# EAGLE design Rocketometer2148 MPU9150 GPS No Osc No Charge (EAGLE 6.5.0)
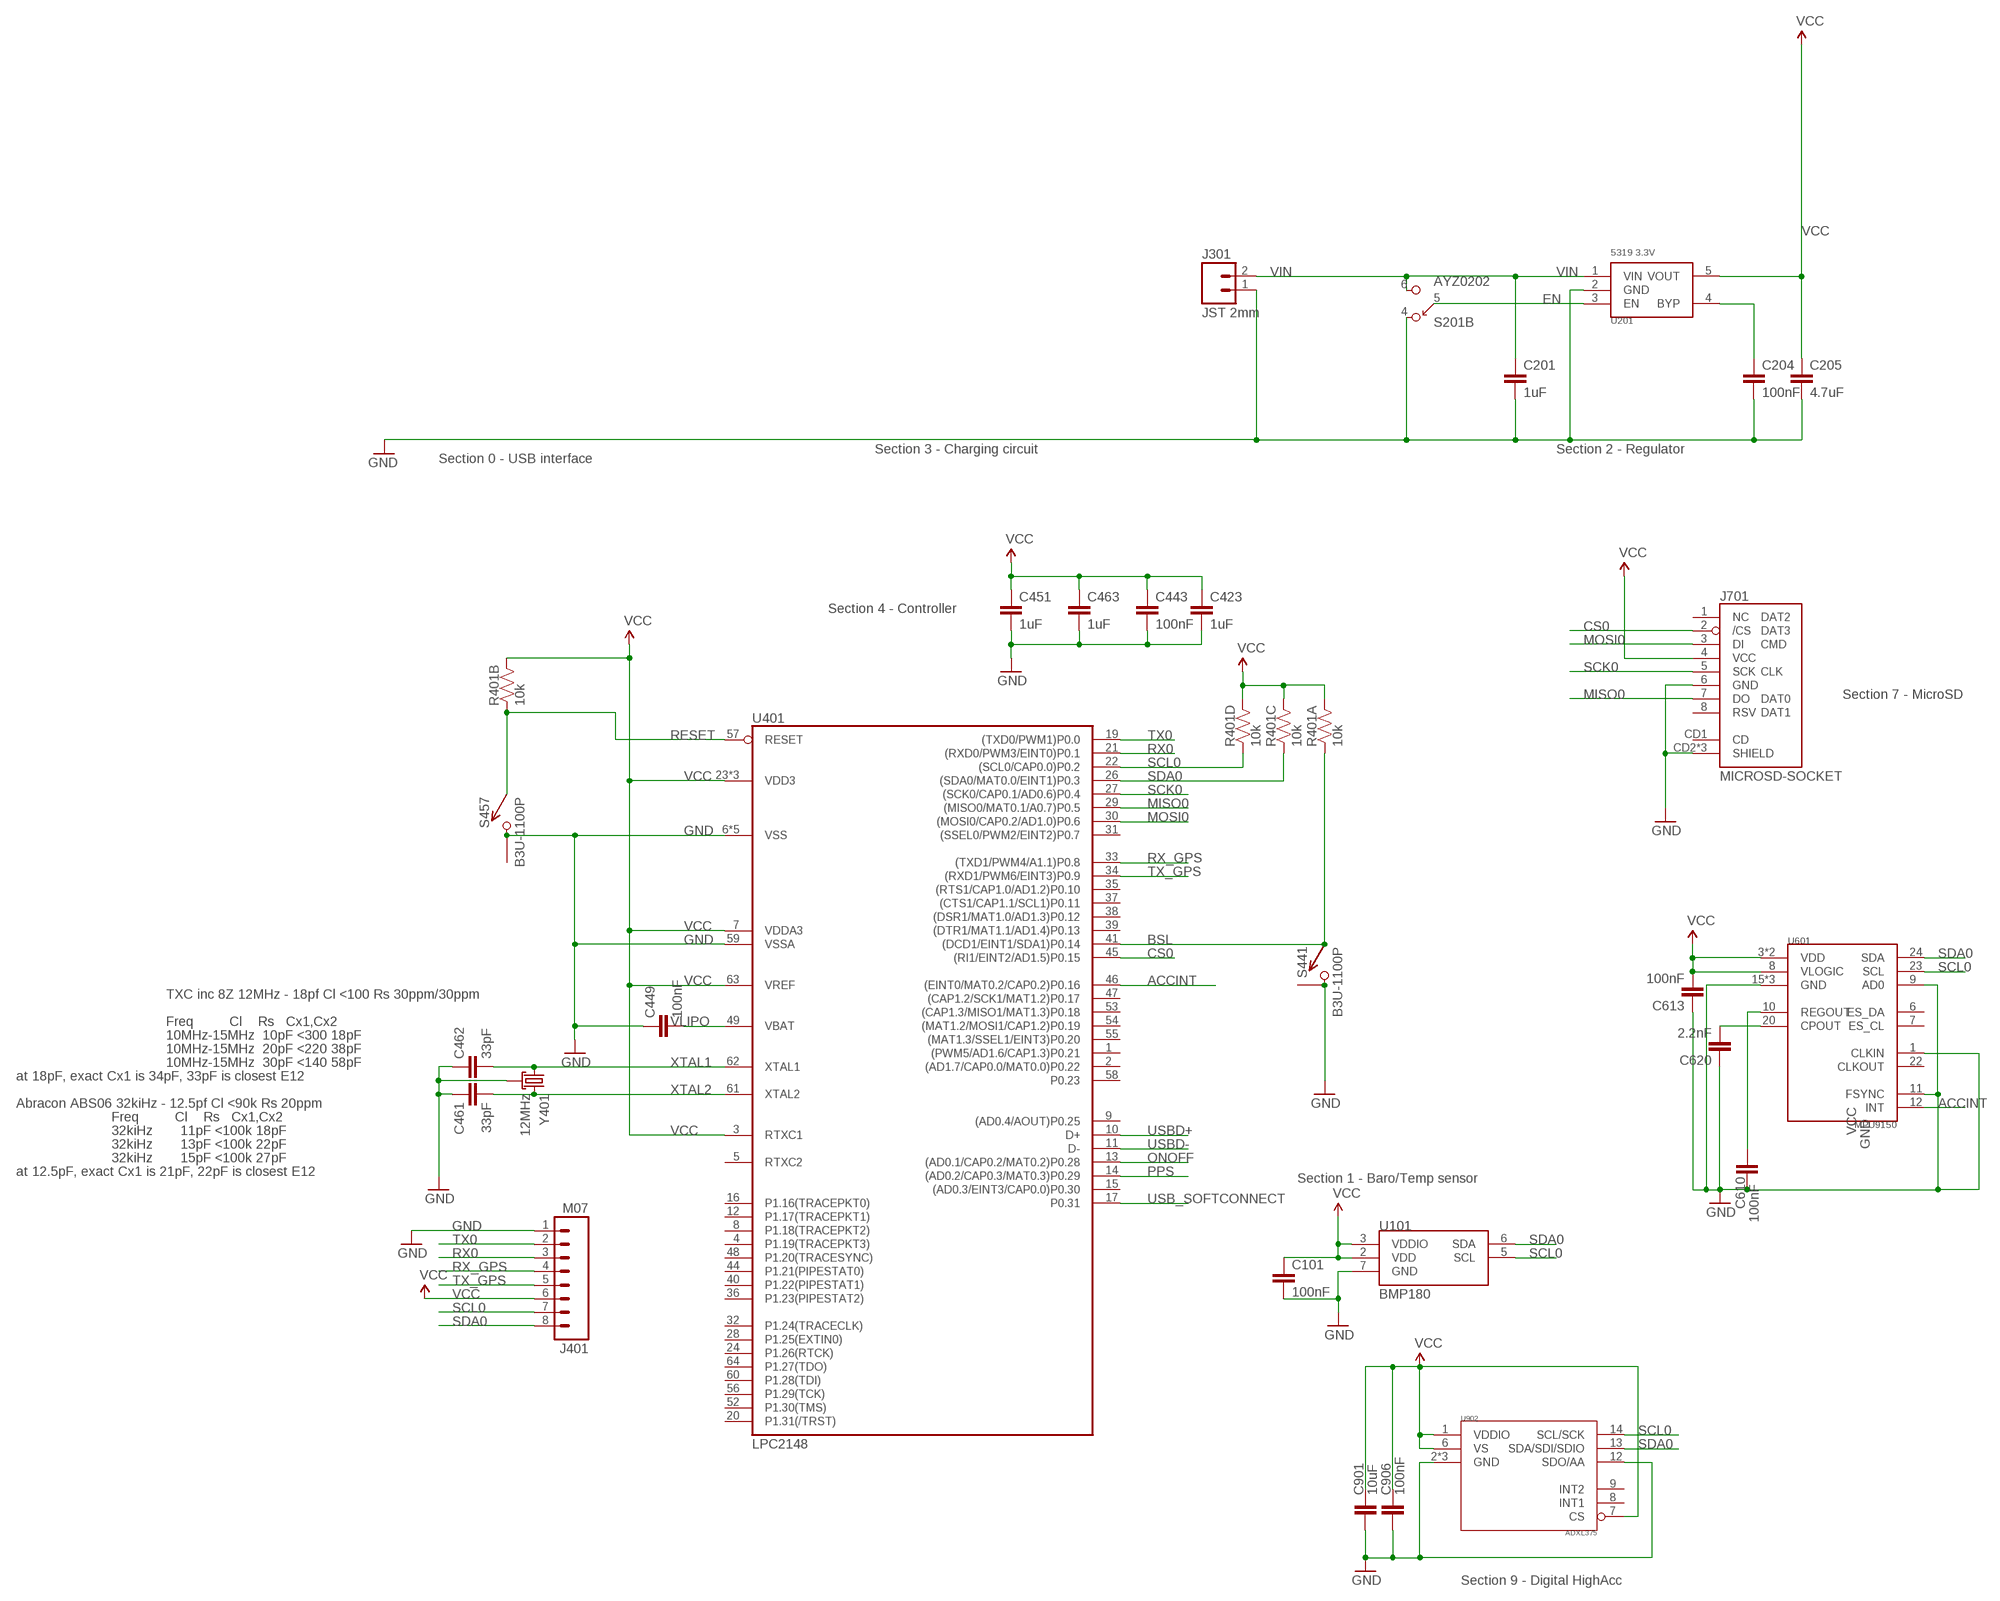
[diagram p0: schematic, sheet 1, part 1 of 2]
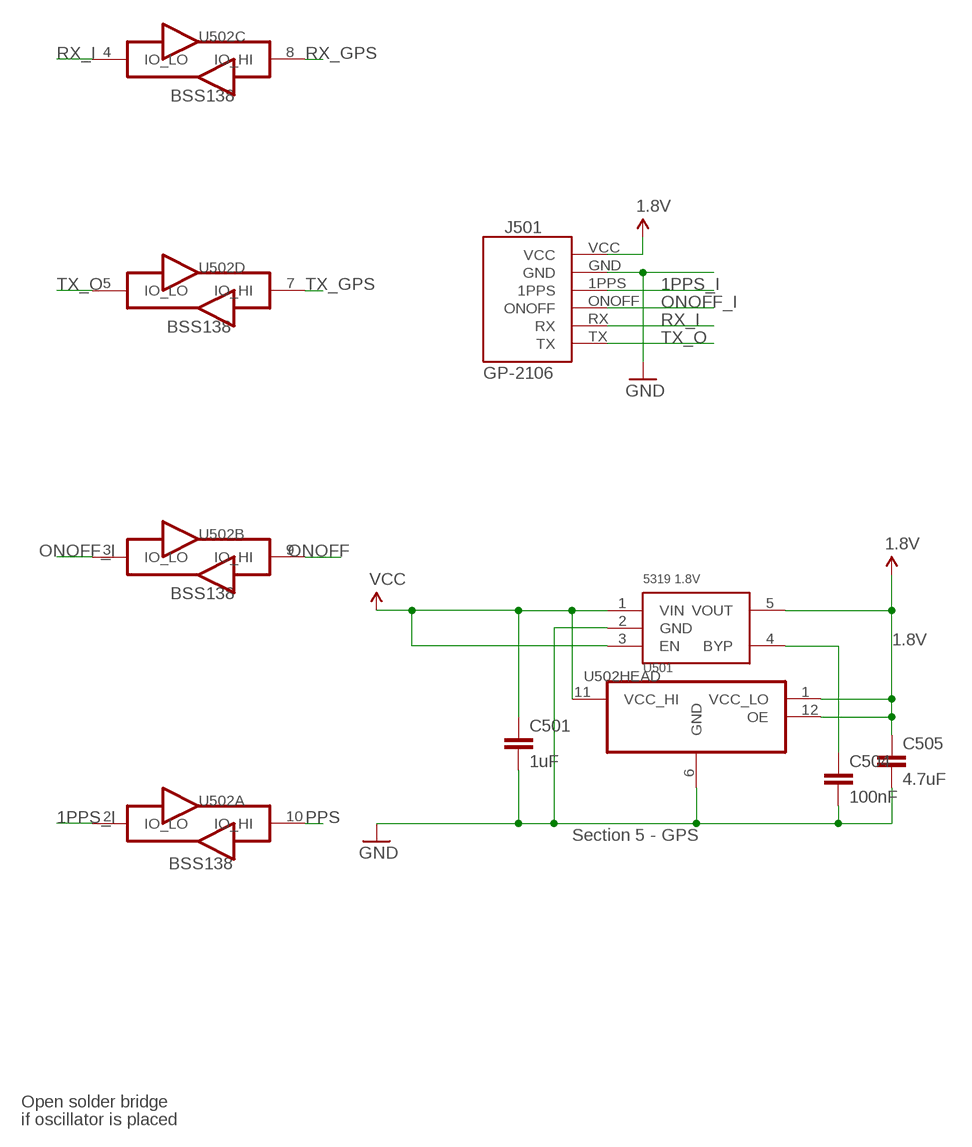
[diagram p1: schematic, sheet 1, part 2 of 2]

## Parts
C101  100nF  CAP0402-CAP  [0402-CAP]
C201  1uF  CAP0402-CAP  [0402-CAP]
C204  100nF  CAP0402-CAP  [0402-CAP]
C205  4.7uF  CAP0402-CAP  [0402-CAP]
C423  1uF  CAP0402-CAP  [0402-CAP]
C443  100nF  CAP0402-CAP  [0402-CAP]
C449  100nF  CAP0402-CAP  [0402-CAP]
C451  1uF  CAP0402-CAP  [0402-CAP]
C461  33pF  CAP0402-CAP  [0402-CAP]
C462  33pF  CAP0402-CAP  [0402-CAP]
C463  1uF  CAP0402-CAP  [0402-CAP]
C501  1uF  CAP0402-CAP  [0402-CAP]
C504  100nF  CAP0402-CAP  [0402-CAP]
C505  4.7uF  CAP0402-CAP  [0402-CAP]
C610  100nF  CAP0402-CAP  [0402-CAP]
C613  100nF  CAP0402-CAP  [0402-CAP]
C620  2.2nF  CAP0402-CAP  [0402-CAP]
C901  10uF  CAP0603-CAP  [0603-CAP]
C906  100nF  CAP0402-CAP  [0402-CAP]
J301  JST 2mm  M02-JST-2MM-SMT  [JST-2-SMD]
J401  M07  M081X08  [1X08]
J501  GP-2106  [GP-2106]
J701  MICROSD-SOCKET  [MICROSD-SOCKET-PP]
R401  10k  RP404  [CRA04]
S201  AYZ0202  [AYZ0202]
S441  B3U-1100P  [B3U-1100P]
S457  B3U-1100P  [B3U-1100P]
U101  BMP180  [BMP180]
U201  5319 3.3V  MIC5319D5  [SOT-23-5]
U401  LPC2148  [LQFP64]
U501  5319 1.8V  MIC5319D5  [SOT-23-5]
U502  TXB0104RUT  [R-PUQFN-N12]
U601  MPU9150  [LLGA24]
U902  ADXL375  [ADXL375]
Y401  12MHz  CX2520  [CRYSTAL_SMD_2MM_2_5MM]

## Nets
1.8V: C505.1 J501.VCC U501.5(VOUT) U502.1(HEAD:VCC_LO) U502.12(HEAD:OE)
1PPS_I: J501.1PPS U502.2(A:IO_LO)
ACCINT: U401.46((EINT0/MAT0.2/CAP0.2)P0.16) U601.12(INT)
BSL: R401.1 S441.P$1 U401.41((DCD1/EINT1/SDA1)P0.14)
CS0: J701.2(/CS) U401.45((RI1/EINT2/AD1.5)P0.15)
EN: S201.5 U201.3(EN)
GND [power]: C101.2 C201.2 C204.2 C205.2 C423.2 C443.2 C449.1 C451.2 C461.1 C462.1 C463.2 C501.2 C504.2 C505.2 C610.2 C613.1 C620.1 C901.2 C906.2 J301.1 J401.1 J501.GND J701.6(GND) J701.CD2(SHIELD) J701.GND1(SHIELD) J701.GND3(SHIELD) S201.4 S441.P$2 S441.P$3 S457.P$2 S457.P$3 U101.7(GND) U201.2(GND) U401.6(VSS) U401.18(VSS) U401.25(VSS) U401.42(VSS) U401.50(VSS) U401.59(VSSA) U501.2(GND) U502.6(HEAD:GND) U601.1(CLKIN) U601.9(AD0) U601.11(FSYNC) U601.15(GND) U601.17(GND) U601.18(GND) U902.2(GND) U902.4(GND) U902.5(GND) U902.12(SDO/AA) Y401.2(GND) Y401.4(GND)
MISO0: J701.7(DO) U401.29((MISO0/MAT0.1/A0.7)P0.5)
MOSI0: J701.3(DI) U401.30((MOSI0/CAP0.2/AD1.0)P0.6)
N$1: C620.2 U601.20(CPOUT)
N$12: C504.1 U501.4(BYP)
N$13: C610.1 U601.10(REGOUT)
N$17: C204.1 U201.4(BYP)
ONOFF: U401.13((AD0.1/CAP0.2/MAT0.2)P0.28) U502.9(B:IO_HI)
ONOFF_I: J501.ONOFF U502.3(B:IO_LO)
PPS: U401.14((AD0.2/CAP0.3/MAT0.3)P0.29) U502.10(A:IO_HI)
RESET [power]: R401.2 S457.P$1 U401.57(RESET)
RX0: J401.3 U401.21((RXD0/PWM3/EINT0)P0.1)
RX_GPS: J401.4 U401.33((TXD1/PWM4/A1.1)P0.8) U502.8(C:IO_HI)
RX_I: J501.RX U502.4(C:IO_LO)
SCK0: J701.5(SCK) U401.27((SCK0/CAP0.1/AD0.6)P0.4)
SCL0: J401.7 R401.4 U101.5(SCL) U401.22((SCL0/CAP0.0)P0.2) U601.23(SCL) U902.14(SCL/SCK)
SDA0: J401.8 R401.3 U101.6(SDA) U401.26((SDA0/MAT0.0/EINT1)P0.3) U601.24(SDA) U902.13(SDA/SDI/SDIO)
TX0: J401.2 U401.19((TXD0/PWM1)P0.0)
TX_GPS: J401.5 U401.34((RXD1/PWM6/EINT3)P0.9) U502.7(D:IO_HI)
TX_O: J501.TX U502.5(D:IO_LO)
USB_SOFTCONNECT: U401.17(P0.31)
USBD+: U401.10(D+)
USBD-: U401.11(D-)
VCC [power]: C101.1 C205.1 C423.1 C443.1 C451.1 C463.1 C501.1 C613.2 C901.1 C906.1 J401.6 J701.4(VCC) R401.5 R401.6 R401.7 R401.8 U101.2(VDD) U101.3(VDDIO) U201.5(VOUT) U401.3(RTXC1) U401.7(VDDA3) U401.23(VDD3) U401.43(VDD3) U401.51(VDD3) U401.63(VREF) U501.1(VIN) U501.3(EN) U502.11(HEAD:VCC_HI) U601.3(VDD) U601.8(VLOGIC) U601.13(VDD) U902.1(VDDIO) U902.6(VS) U902.7(CS)
VIN: C201.1 S201.6 U201.1(VIN)
VLIPO [power]: C449.2 U401.49(VBAT)
XTAL1: C462.2 U401.62(XTAL1) Y401.1
XTAL2: C461.2 U401.61(XTAL2) Y401.3
Unconnected: J301.2 J701.1(NC) J701.8(RSV) J701.CD1(CD) S201.1 S201.2 S201.3 U401.1((PWM5/AD1.6/CAP1.3)P0.21) U401.2((AD1.7/CAP0.0/MAT0.0)P0.22) U401.4(P1.19(TRACEPKT3)) U401.5(RTXC2) U401.8(P1.18(TRACEPKT2)) U401.9((AD0.4/AOUT)P0.25) U401.12(P1.17(TRACEPKT1)) U401.15((AD0.3/EINT3/CAP0.0)P0.30) U401.16(P1.16(TRACEPKT0)) U401.20(P1.31(/TRST)) U401.24(P1.26(RTCK)) U401.28(P1.25(EXTIN0)) U401.31((SSEL0/PWM2/EINT2)P0.7) U401.32(P1.24(TRACECLK)) U401.35((RTS1/CAP1.0/AD1.2)P0.10) U401.36(P1.23(PIPESTAT2)) U401.37((CTS1/CAP1.1/SCL1)P0.11) U401.38((DSR1/MAT1.0/AD1.3)P0.12) U401.39((DTR1/MAT1.1/AD1.4)P0.13) U401.40(P1.22(PIPESTAT1)) U401.44(P1.21(PIPESTAT0)) U401.47((CAP1.2/SCK1/MAT1.2)P0.17) U401.48(P1.20(TRACESYNC)) U401.52(P1.30(TMS)) U401.53((CAP1.3/MISO1/MAT1.3)P0.18) U401.54((MAT1.2/MOSI1/CAP1.2)P0.19) U401.55((MAT1.3/SSEL1/EINT3)P0.20) U401.56(P1.29(TCK)) U401.58(P0.23) U401.60(P1.28(TDI)) U401.64(P1.27(TDO)) U601.6(ES_DA) U601.7(ES_CL) U601.22(CLKOUT) U902.8(INT1) U902.9(INT2)

## Notes on the sheet
- BSS138
- Section 0 - USB interface | Section 3 - Charging circuit | Section 2 - Regulator
- BSS138
- Section 4 - Controller
- BSS138
- Section 7 - MicroSD
- Section 5 - GPS
- BSS138
- TXC inc 8Z 12MHz - 18pf Cl <100 Rs 30ppm/30ppm
- Freq         Cl    Rs   Cx1,Cx2
- 10MHz-15MHz  10pF <300 18pF
- 10MHz-15MHz  20pF <220 38pF
- 10MHz-15MHz  30pF <140 58pF | Open solder bridge
- at 18pF, exact Cx1 is 34pF, 33pF is closest E12 | if oscillator is placed
- Abracon ABS06 32kiHz - 12.5pf Cl <90k Rs 20ppm
- Freq         Cl    Rs   Cx1,Cx2
- 32kiHz       11pF <100k 18pF
- 32kiHz       13pF <100k 22pF
- 32kiHz       15pF <100k 27pF
- at 12.5pF, exact Cx1 is 21pF, 22pF is closest E12
- Section 1 - Baro/Temp sensor
- Section 9 - Digital HighAcc

## Library data of the parts
C101 C204 C443 C449 C504 C610 C613 = SparkFun:CAP: Capacitor Standard 0603 ceramic capacitor, and 0.1" leaded capacitor.; DIGIKEY: 445-1265-1-ND
C201 C423 C451 C463 C501 = SparkFun:CAP: Capacitor Standard 0603 ceramic capacitor, and 0.1" leaded capacitor.; DIGIKEY: 445-4114-1-ND
C205 C505 = SparkFun:CAP: Capacitor Standard 0603 ceramic capacitor, and 0.1" leaded capacitor.; DIGIKEY: 445-7395-1-ND
C461 C462 = SparkFun:CAP: Capacitor Standard 0603 ceramic capacitor, and 0.1" leaded capacitor.; DIGIKEY: 445-1241-1-ND
C620 = SparkFun:CAP: Capacitor Standard 0603 ceramic capacitor, and 0.1" leaded capacitor.; DIGIKEY: 445-1257-1-ND
C901 = SparkFun:CAP: Capacitor Standard 0603 ceramic capacitor, and 0.1" leaded capacitor.; DIGIKEY: 445-7486-1-ND
C906 = SparkFun-Passives:CAP: Capacitor Standard 0603 ceramic capacitor, and 0.1" leaded capacitor.; DIGIKEY: 445-1265-1-ND
J301 = SparkFun:M02: Header 2 Standard 2-pin 0.1" header. Use with straight break away headers (SKU : PRT-00116), right angle break away headers (PRT-00553), swiss pins (PRT-00743), machine pins (PRT-00117), and female headers (PRT-00115). Molex polarized connector foot print use with SKU : PRT-08233 with associated crimp pins and housings.; DIGIKEY: 455-1749-1-ND
J401 = SparkFun-Connectors:M08: Header 8 Standard 8-pin 0.1" header. Use with straight break away headers (SKU : PRT-00116), right angle break away headers (PRT-00553), swiss pins (PRT-00743), machine pins (PRT-00117), and female headers (PRT-00115).; DIGIKEY: $NOPART
J501 = SparkFun:GP-2106: GP-2106 GPS SiRF IV
J701 = KwanSystems:MICROSD-SOCKET: microSD Socket Push-push type uSD socket. Digikey 101-00660-68-6-1-ND. tDoc lines correctly indicate media card edge positions when inserting (unlocked, locked, depressed).; DIGIKEY: 101-00581-59-1-ND
R401 = KwanSystems:RP4; DIGIKEY: CRA4S810KCT-ND
S201 = KwanSystems:AYZ0202; DIGIKEY: 401-2013-1-ND
S441 S457 = KwanSystems:B3U-1100P; DIGIKEY: SW1021CT-ND
U101 = KwanSystems:BMP180; DIGIKEY: 828-1027-1-ND
U201 U501 = KwanSystems:MIC5319; DIGIKEY: 576-1910-1-ND
U401 = KwanSystems:LPC2148
U502 = KwanSystems:TXB0104
U601 = KwanSystems:MPU9150; DIGIKEY: $NOPART
U902 = KwanSystems:ADXL375; DIGIKEY: ADXL375BCCZ-ND
Y401 = KwanSystems:CX2520; DIGIKEY: 887-1487-1-ND

## Net classes
0 default: width 0.152 mm, drill 0.33 mm, clearance 0.152 mm
1 power: width 0.152 mm, drill 0.33 mm, clearance 0.152 mm to class 0, clearance 0.152 mm
2 hv: width 0.152 mm, drill 0.33 mm, clearance 0.152 mm to class 0, clearance 0.152 mm to class 1, clearance 0.152 mm

## Board
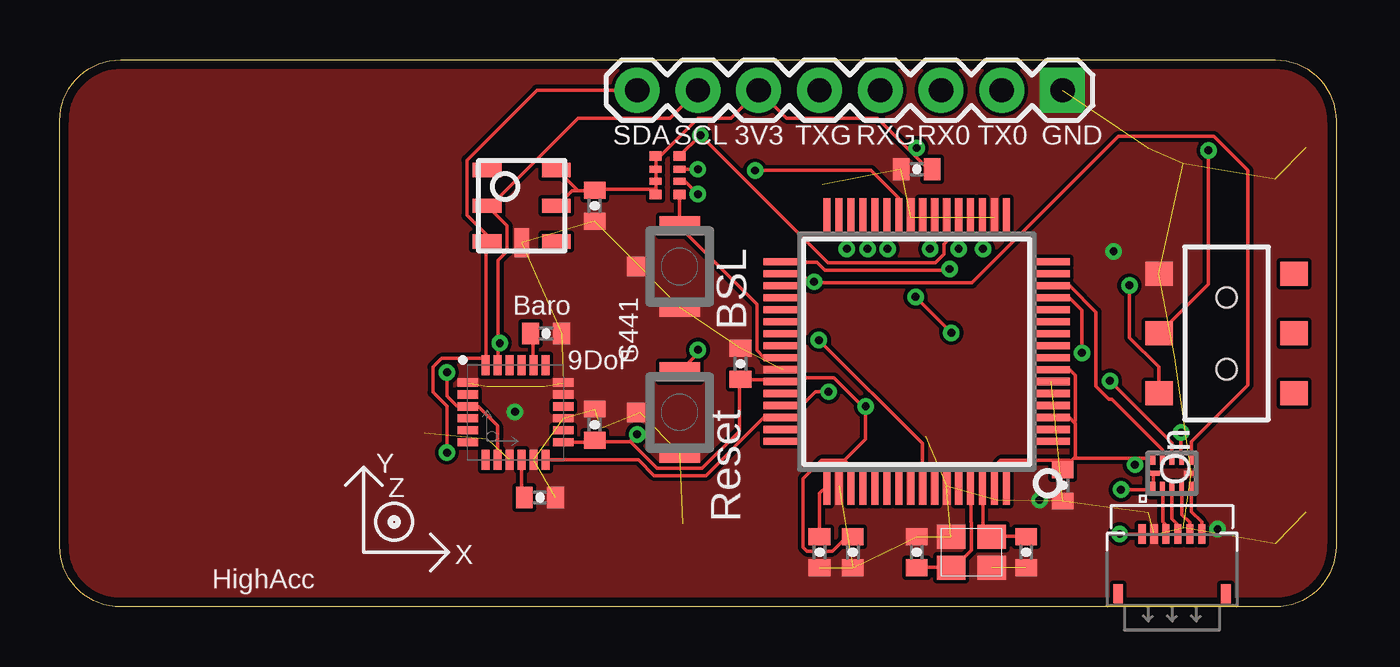
[diagram p2: board, top side]
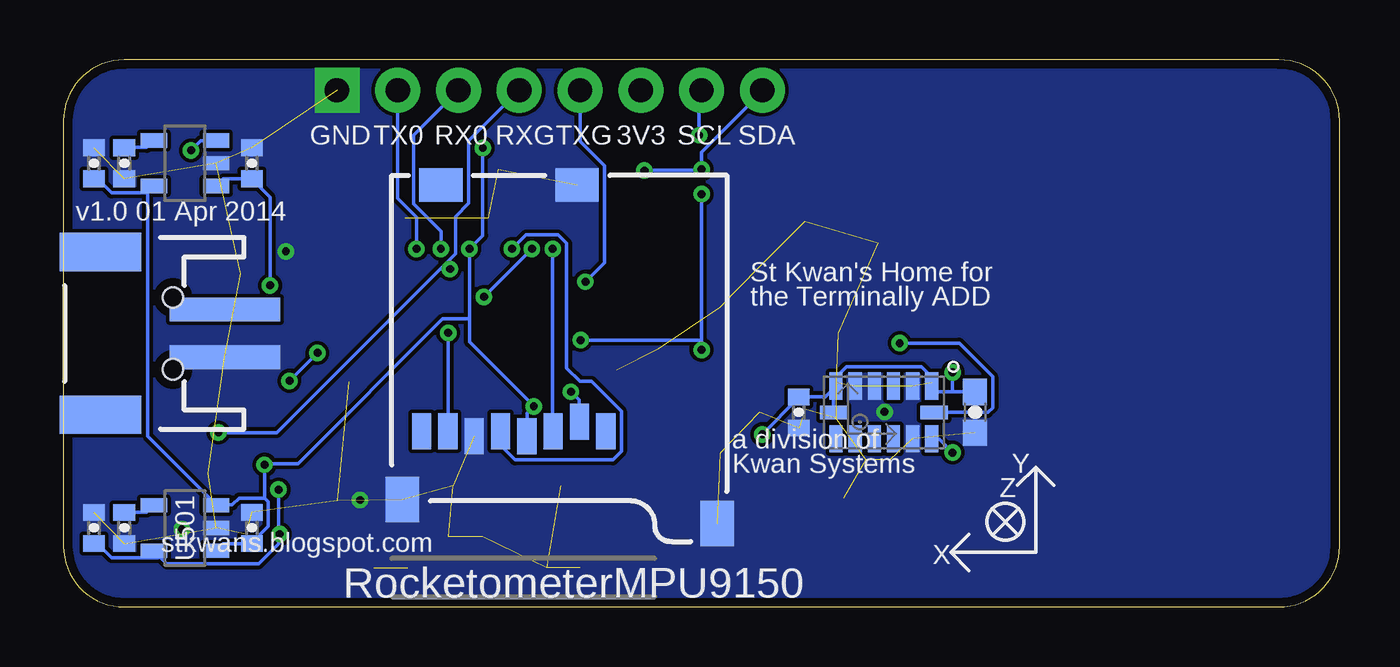
[diagram p3: board, bottom side, seen from below]

Size 53.34 x 22.86 mm. Coordinates in mm from the lower left corner, seen from the top.
Outline: 2.54,22.86 50.8,22.86 arc-90 53.34,20.32 53.34,2.54 arc-90 50.8,0 2.54,0 arc-90 0,2.54 0,20.32 arc-90 2.54,22.86
Copper layers (1*16): Top 0.0356mm / dielectric 1.5011mm / Bottom 0.0356mm
Design rules "default": minimum track width 6mil, minimum drill 13mil, track to track 6mil, track to pad 6mil, pad to pad 6mil, via to via 6mil, smd to smd 6mil, copper to edge 15mil, drill to drill 6mil, minimum pad ring 7mil, minimum via ring 7mil, stop-mask expansion 4mil, vias tented up to drill 14mil, thermal gap 10mil

### Footprints (pad centres in the part's own frame; a part is rotated, then mirrored left to right if it is on the bottom)
0402-CAP = smd 0.7 x 0.9: 1 -0.65,0; 2 0.65,0
0603-CAP = smd 1.1 x 1: 1 -0.85,0; 2 0.85,0
JST-2-SMD = smd 1 x 4.6: 1 -1,-3.7; 2 1,-3.7 | smd 1.6 x 3.4: NC1 -3.4,1.5; NC2 3.4,1.5
1X08 = drill 1.016 pad 1.88 square: 1 0,0 | drill 1.016 pad 1.88: 2 2.54,0; 3 5.08,0; 4 7.62,0; 5 10.16,0; 6 12.7,0; 7 15.24,0; 8 17.78,0
GP-2106 = smd 0.3 x 0.8: 1PPS -0.25,0; GND -0.75,0; ONOFF 0.25,0; RX 0.75,0; TX 1.25,0; VCC -1.25,0 | smd 0.4 x 0.8: P$7 -2.25,-2.5; P$8 2.25,-2.5
MICROSD-SOCKET-PP = smd 0.8 x 1.5: 1 -8.94,10.7; 2 -7.84,10.3; 3 -6.74,10.7; 4 -5.64,10.9; 5 -4.54,10.7; 6 -3.44,10.9; 7 -2.34,10.7; 8 -1.24,10.7 | smd 1.8 x 1.4: CD1 -2.05,0.4; CD2 -7.75,0.4 | smd 1.4 x 1.9: GND1 -13.6,14.55; GND3 -0.45,13.55
CRA04 = smd 0.4 x 0.5: 1 -0.8,-0.5; 4 0.8,-0.5; 5 0.8,0.5; 8 -0.8,0.5 | smd 0.3 x 0.5: 2 -0.25,-0.5; 3 0.25,-0.5; 6 0.25,0.5; 7 -0.25,0.5
AYZ0202 = smd 1 x 1.15: 1 -2.5,2.825; 2 0,2.825; 3 2.5,2.825; 4 -2.5,-2.825; 5 0,-2.825; 6 2.5,-2.825 | hole 0.85: 1.5,0; -1.5,0
B3U-1100P = smd 0.8 x 1.7: P$1 -1.7,0; P$2 1.7,0 | smd 0.8 x 1.1: P$3 0,-1.65
BMP180 = smd 0.6 x 1.2: 1 1.5,1.45; 2 0,1.45; 3 -1.5,1.45; 4 -1.5,-1.45; 5 0,-1.45; 6 1.5,-1.45 | smd 1.2 x 0.6: 7 1.55,0
SOT-23-5 = smd 0.6 x 1.1: 1 -0.95,-1.3; 2 0,-1.3; 3 0.95,-1.3; 4 0.95,1.3; 5 -0.95,1.3
LQFP64 = smd 0.3 x 1.6: 1 -3.75,-5.6; 2 -3.25,-5.6; 3 -2.75,-5.6; 4 -2.25,-5.6; 5 -1.75,-5.6; 6 -1.25,-5.6; 7 -0.75,-5.6; 8 -0.25,-5.6; 9 0.25,-5.6; 10 0.75,-5.6; 11 1.25,-5.6; 12 1.75,-5.6; 13 2.25,-5.6; 14 2.75,-5.6; 15 3.25,-5.6; 16 3.75,-5.6; 33 3.75,5.6; 34 3.25,5.6; 35 2.75,5.6; 36 2.25,5.6; 37 1.75,5.6; 38 1.25,5.6; 39 0.75,5.6; 40 0.25,5.6; 41 -0.25,5.6; 42 -0.75,5.6; 43 -1.25,5.6; 44 -1.75,5.6; 45 -2.25,5.6; 46 -2.75,5.6; 47 -3.25,5.6; 48 -3.75,5.6 | smd 1.6 x 0.3: 17 5.6,-3.75; 18 5.6,-3.25; 19 5.6,-2.75; 20 5.6,-2.25; 21 5.6,-1.75; 22 5.6,-1.25; 23 5.6,-0.75; 24 5.6,-0.25; 25 5.6,0.25; 26 5.6,0.75; 27 5.6,1.25; 28 5.6,1.75; 29 5.6,2.25; 30 5.6,2.75; 31 5.6,3.25; 32 5.6,3.75; 49 -5.6,3.75; 50 -5.6,3.25; 51 -5.6,2.75; 52 -5.6,2.25; 53 -5.6,1.75; 54 -5.6,1.25; 55 -5.6,0.75; 56 -5.6,0.25; 57 -5.6,-0.25; 58 -5.6,-0.75; 59 -5.6,-1.25; 60 -5.6,-1.75; 61 -5.6,-2.25; 62 -5.6,-2.75; 63 -5.6,-3.25; 64 -5.6,-3.75
R-PUQFN-N12 = smd 0.2 x 0.6: 1 -0.8,-0.65; 2 -0.4,-0.65; 3 0,-0.65; 4 0.4,-0.65; 5 0.8,-0.65; 7 0.8,0.65; 8 0.4,0.65; 9 0,0.65; 10 -0.4,0.65; 11 -0.8,0.65 | smd 0.6 x 0.2: 6 0.8,0; 12 -0.8,0
LLGA24 = smd 0.85 x 0.34: 1 -2,1.25; 2 -2,0.75; 3 -2,0.25; 4 -2,-0.25; 5 -2,-0.75; 6 -2,-1.25; 13 2,-1.25; 14 2,-0.75; 15 2,-0.25; 16 2,0.25; 17 2,0.75; 18 2,1.25 | smd 0.34 x 0.85: 7 -1.25,-1.975; 8 -0.75,-1.975; 9 -0.25,-1.975; 10 0.25,-1.975; 11 0.75,-1.975; 12 1.25,-1.975; 19 1.25,1.975; 20 0.75,1.975; 21 0.25,1.975; 22 -0.25,1.975; 23 -0.75,1.975; 24 -1.25,1.975
ADXL375 = smd 0.55 x 1.145: 1 2,1.097; 2 1.2,1.097; 3 0.4,1.097; 4 -0.4,1.097; 5 -1.2,1.097; 6 -2,1.097; 8 -2,-1.097; 9 -1.2,-1.097; 10 -0.4,-1.097; 11 0.4,-1.097; 12 1.2,-1.097; 13 2,-1.097 | smd 1.145 x 0.55: 7 -2.098,0; 14 2.098,0
CRYSTAL_SMD_2MM_2_5MM = smd 1.2 x 1: 1 -0.85,-0.65; 2 0.85,-0.65; 3 0.85,0.65; 4 -0.85,0.65

### Placement (x,y rotation side)
C101  22.35,16.76 270 top
C201  45.47,18.54 90 bottom
C204  50.8,18.54 270 bottom
C205  52.07,18.54 90 bottom
C423  35.81,18.29 180 top
C443  28.45,10.16 90 top
C449  31.75,2.29 90 top
C451  33.15,2.29 270 top
C461  35.81,2.29 270 top
C462  40.39,2.29 90 top
C463  41.91,5.08 270 top
C501  45.47,3.3 90 bottom
C504  50.8,3.3 270 bottom
C505  52.07,3.3 90 bottom
C610  20.07,4.57 0 top
C613  22.35,7.62 270 top
C620  20.32,11.43 180 top
C901  15.24,8.13 270 bottom
C906  22.61,8.13 270 bottom
J301  50.29,11.43 90 bottom
J401  41.91,21.59 180 top
J501  46.48,3.05 0 top
J701  39.62,18.03 180 bottom
R401  25.4,18.03 90 top
S201  48.77,11.43 270 top
S441  25.91,14.22 270 top
S457  25.91,8.13 270 top
U101  19.3,16.76 270 top
U201  48.26,18.54 90 bottom
U401  35.81,10.67 90 top
U501  48.26,3.3 90 bottom
U502  46.48,5.59 0 top
U601  19.05,8.13 0 top
U902  19.05,8.13 0 bottom
U$4  [AXES]  12.7,2.29 0 top
Y401  38.1,2.29 180 top

### Tracks (layer width: path | path; a pad name or v marks a point on that pad's centre or on a via)
1.8V  (via drill 0.33)
  Top 0.152: U502.12 45.7,5.59 45.7,4.95 U502.1 45.62,4.9 v44.35,4.9 | v44.3,3.05 J501.VCC
  Bottom 0.152: 44.35,3.05 44.35,2.64 45.19,1.8 49.02,1.8 49.55,2.34 U501.5 49.38,2.06 51.33,2.06 51.92,2.64 C505.1 | 44.35,3.05 v44.35,4.9 | v44.3,3.05 44.35,3.05
1PPS_I
  Top 0.152: U502.2 46.1,4.93 46.1,3.56 46.23,3.43 J501.1PPS
ACCINT
  Top 0.152: U601.12 20.32,6.15 24.18,6.15 24.84,5.49 27,5.49 29.41,7.9 30.2,7.9 U401.46
BSL
  Top 0.152: R401.1 S441.P$1 25.93,15.85 29.13,12.65 29.13,10.72 29.41,10.44 30.2,10.44 U401.41
CS0  (via drill 0.33)
  Top 0.152: v32.13,8.99 31.57,8.99 31.01,8.43 30.23,8.43 U401.45
  Bottom 0.152: v32.13,8.99 31.8,8.66 31.8,7.75 J701.2
EN  (via drill 0.33)
  Top 0.152: v48.01,19.07 48.01,13.49 S201.5
  Bottom 0.152: v48.01,19.07 47.6,19.48 U201.3
GND  (via drill 0.33)  (49 unrouted)
  other vias: 19.02,8.15 48.39,3.25 44.04,14.86 40.94,4.47
  pour Top (no thermals): 2.54,22.86 50.8,22.86 53.34,22.86 53.34,2.54 arc-90 50.8,0 2.54,0 arc-90 0,2.54 0,20.32 arc-90
  pour Bottom (no thermals): 2.54,22.86 50.8,22.86 53.34,22.86 53.34,2.54 arc-90 50.8,0 2.54,0 arc-90 0,2.54 0,20.32 arc-90
MISO0  (via drill 0.33)
  Top 0.152: v35.76,12.95 v37.26,11.46 | v33.76,14.96 33.76,15.29 33.58,15.47 33.58,16.26 U401.29
  Bottom 0.152: v37.26,11.46 37.26,7.34 J701.7 | v33.76,14.96 v35.76,12.95
MOSI0  (via drill 0.33)
  Top 0.152: v32.89,14.96 32.89,15.32 33.05,15.47 33.05,16.26 U401.30
  Bottom 0.152: v32.89,14.96 32.89,7.34 J701.3
N$1
  Top 0.152: U601.20 19.79,10.11 19.79,11.33 19.68,11.43 C620.2
N$12
  Bottom 0.152: C504.1 50.8,3.96 49.86,3.96 49.58,4.24 U501.4
N$13
  Top 0.152: U601.10 19.3,4.67 19.41,4.57 C610.1
N$17
  Bottom 0.152: C204.1 50.8,19.2 49.86,19.2 49.58,19.48 U201.4
ONOFF  (via drill 0.33)
  Top 0.152: U502.9 46.48,6.86 v43.89,9.45 | v42.72,10.62 42.72,12.39 42.22,12.9 41.43,12.9 U401.13
  Bottom 0.152: v42.72,10.62 v43.89,9.45
ONOFF_I
  Top 0.152: U502.3 46.48,3.68 46.71,3.45 46.71,3.05 J501.ONOFF
PPS
  Top 0.152: U502.10 46.08,6.58 43.97,8.69 43.84,8.69 43.31,9.22 43.31,12.32 42.22,13.41 41.43,13.41 U401.14
RESET  (via drill 0.33)
  Top 0.152: v26.67,17.25 26.14,17.78 R401.2 | v26.67,10.74 26.67,10.59 S457.P$1 | v31.73,11.15 36.04,6.83 36.04,5.08 U401.57
  Bottom 0.152: v26.67,10.74 26.67,11.15 | 26.67,11.15 v26.67,17.25 | 26.67,11.15 v31.73,11.15
RX0  (via drill 0.33)
  Top 0.152: v37.57,14.96 37.57,16.26 U401.21
  Bottom 0.152: v37.57,14.96 37.57,15.7 38.71,16.84 38.71,19.71 J401.3
RX_GPS  (via drill 0.33)
  Top 0.152: v46.86,7.29 46.86,6.25 U502.8 | v37.19,14.12 37.13,14.07 31.98,14.07 31.65,14.4 30.23,14.4 U401.33
  Bottom 0.152: v46.86,7.29 44.42,7.29 37.39,14.33 | 37.39,14.33 36.96,14.76 36.96,16.31 36.4,16.87 36.4,19.48 J401.4 | 37.39,14.33 v37.19,14.12
RX_I
  Top 0.152: U502.4 46.89,4.93 46.89,3.86 47.22,3.53 J501.RX
SCK0  (via drill 0.33)
  Top 0.152: v34.59,14.96 34.59,16.23 34.57,16.26 U401.27
  Bottom 0.152: v34.59,14.96 34.01,15.54 32.66,15.54 32.31,15.19 32.31,9.98 31.75,9.42 31.27,9.42 30.02,8.18 30.02,6.5 30.38,6.15 34.47,6.15 35.05,6.73 35.05,7.32 J701.5
SCL0  (via drill 0.33)
  Top 0.152: 18.31,11.02 18.31,14.48 18.69,14.86 18.69,15.93 U101.5 17.98,16.74 21.67,20.42 25.5,20.42 J401.7 | 18.31,11.02 18.31,10.11 U601.23 | v18.39,11.02 18.31,11.02 | R401.4 25.91,18.85 v26.77,19.71 32.11,14.38 36.6,14.38 36.96,14.73 36.96,15.16 37.06,15.27 37.06,16.26 U401.22
  Bottom 0.152: U902.14 14.71,8.13 14.5,8.33 14.5,9.63 15.9,11.02 v18.39,11.02 | v26.77,19.71 26.77,21.49 J401.7
SDA0  (via drill 0.33)
  Top 0.152: v16.18,6.45 16.18,8.38 15.6,8.97 15.6,10.03 15.95,10.39 17.75,10.39 U601.24 17.8,15.21 17.83,15.24 U101.6 17.8,15.32 17.8,15.57 17.02,16.36 17.02,18.67 19.94,21.59 J401.8 | v26.67,18.29 R401.3 | v29.06,18.24 33.91,18.24 35.05,17.09 U401.26
  Bottom 0.152: v16.18,6.45 16.74,7.01 17.04,7.01 U902.13 | J401.8 24.13,21.54 26.67,19 v26.67,18.29 26.72,18.24 v29.06,18.24
TX0  (via drill 0.33)
  Top 0.152: v38.58,14.96 38.58,16.26 U401.19
  Bottom 0.152: v38.58,14.96 38.58,16.28 39.37,17.07 J401.2
TX_GPS  (via drill 0.33)
  Top 0.152: 31.52,13.54 31.37,13.54 31.01,13.89 30.23,13.89 U401.34 | 31.52,13.54 38.12,13.54 44.25,19.66 48.23,19.66 49.66,18.24 49.66,9.27 47.3,6.91 47.3,6.25 U502.7 | v31.52,13.59 31.52,13.54
  Bottom 0.152: J401.5 31.75,19.46 30.73,18.44 30.73,14.38 v31.52,13.59
TX_O
  Top 0.152: U502.5 47.3,4.93 47.3,3.99 47.73,3.56 J501.TX
VCC  (via drill 0.33)
  Top 0.152: 42.44,6.22 42.39,6.22 42.24,6.07 | 42.44,6.22 44.93,6.22 | 44.93,6.22 45.67,6.22 U502.11 | 42.24,6.07 C463.1 | U401.63 39.06,5.87 39.32,6.12 42.19,6.12 42.24,6.07 | 42.39,7.72 42.44,7.67 42.44,6.22 | 42.39,7.72 42.22,7.9 41.43,7.9 U401.3 | U401.7 41.43,9.91 42.22,9.91 42.44,9.68 42.44,7.77 42.39,7.72 | v44.93,5.94 44.93,6.22 | 24.92,17.45 24.92,17.78 R401.7 24.92,17.86 24.92,18.26 R401.6 24.92,18.34 24.92,18.82 R401.5 24.99,18.82 25.07,18.82 26.67,20.42 28.04,20.42 J401.6 30.38,20.42 34.16,20.42 35.61,18.97 | 24.92,17.45 24.92,17.25 R401.8 | 21.59,17.4 21.41,17.4 20.78,16.76 U101.2 | 21.59,17.4 C101.1 22.4,17.45 24.92,17.45 | U101.3 20.78,18.26 21.59,17.45 21.59,17.4 | C423.1 36.3,18.29 35.61,18.97 | 32.79,6.12 31.83,6.12 31.06,5.36 31.06,2.49 31.22,2.34 32.28,2.34 32.87,2.92 33.15,2.92 C451.1 | 32.79,6.12 33.05,5.87 33.05,5.08 U401.51 | 32.79,6.12 33.68,7.01 v33.68,8.38 33.63,8.43 33.5,8.43 32.36,9.58 31.17,9.58 31.04,9.45 30.28,9.45 U401.43 30.12,9.5 C443.1 28.4,9.45 28.4,7.34 26.85,5.79 24.97,5.79 23.85,6.91 | v36.37,14.96 36.55,15.14 36.55,16.26 U401.23 | U601.8 18.29,6.17 18.29,7.57 17.5,8.36 17.07,8.36 U601.3 16.99,8.41 16.59,8.41 16.18,8.81 v16.18,9.8 | U601.13 22.28,6.88 C613.2 22.4,6.91 23.85,6.91 | v24.13,7.21 23.88,6.96 23.85,6.91 | v35.81,19.18 35.61,18.97
  Bottom 0.152: 49.86,17.3 51.33,17.3 51.92,17.88 C205.1 | 49.86,17.3 49.58,17.58 U201.5 | U501.1 46.94,2.36 46.66,2.64 C501.1 45.44,2.72 44.78,3.38 44.78,4.39 44.93,4.55 | 44.93,4.55 46,4.55 46.28,4.27 46.94,4.27 U501.3 46.99,4.32 49.81,7.14 49.81,17.25 49.86,17.3 | 44.93,4.55 v44.93,5.94 44.88,5.99 43.54,5.99 37.49,12.04 36.37,12.04 | J701.4 33.96,7.14 33.96,8.1 v33.68,8.38 36.37,11.07 36.37,12.04 | 36.37,12.04 v36.37,14.96 35.81,15.52 v35.81,19.18 | 16.18,8.99 16.82,8.99 U902.1 17.07,9.3 17.07,9.63 17.48,10.03 20.62,10.03 21.03,9.63 21.03,9.3 U902.6 | 16.18,8.99 15.24,8.99 C901.1 | U902.6 21.49,8.79 C906.1 22.63,8.71 v24.13,7.21 | U902.7 21.16,9.02 U902.6 | 16.18,8.99 v16.18,9.8
VIN  (via drill 0.33)
  Top 0.152: v44.7,13.44 44.7,11.25 45.92,10.03 45.92,8.94 S201.6
  Bottom 0.152: U201.1 46.94,17.6 46.66,17.88 C201.1 45.41,17.83 44.7,17.12 v44.7,13.44
VLIPO
  Top 0.152: C449.2 31.75,4.75 32.05,5.05 U401.49
XTAL1
  Top 0.152: C462.2 38.96,2.95 Y401.1 38.94,3.02 38.58,3.38 38.58,5.05 U401.62
XTAL2
  Top 0.152: C461.2 35.81,1.65 37.24,1.65 Y401.3 37.31,1.68 37.41,1.68 38.1,2.36 38.1,3.53 38.08,3.56 38.08,5.05 U401.61

### Text on the board
tPlace: SDA | SCL | 3V3 | TXG | RXG | RX0 | TX0 | GND | BSL | Baro | 9DoF | On | Reset | HighAcc
bPlace: SDA | SCL | 3V3 | TXG | RXG | RX0 | TX0 | GND | v1.0 01 Apr 2014 | St Kwan's Home for | the Terminally ADD | a division of | Kwan Systems | stkwans.blogspot.com | RocketometerMPU9150